# Altium project meltdown_hardware.PrjPcb
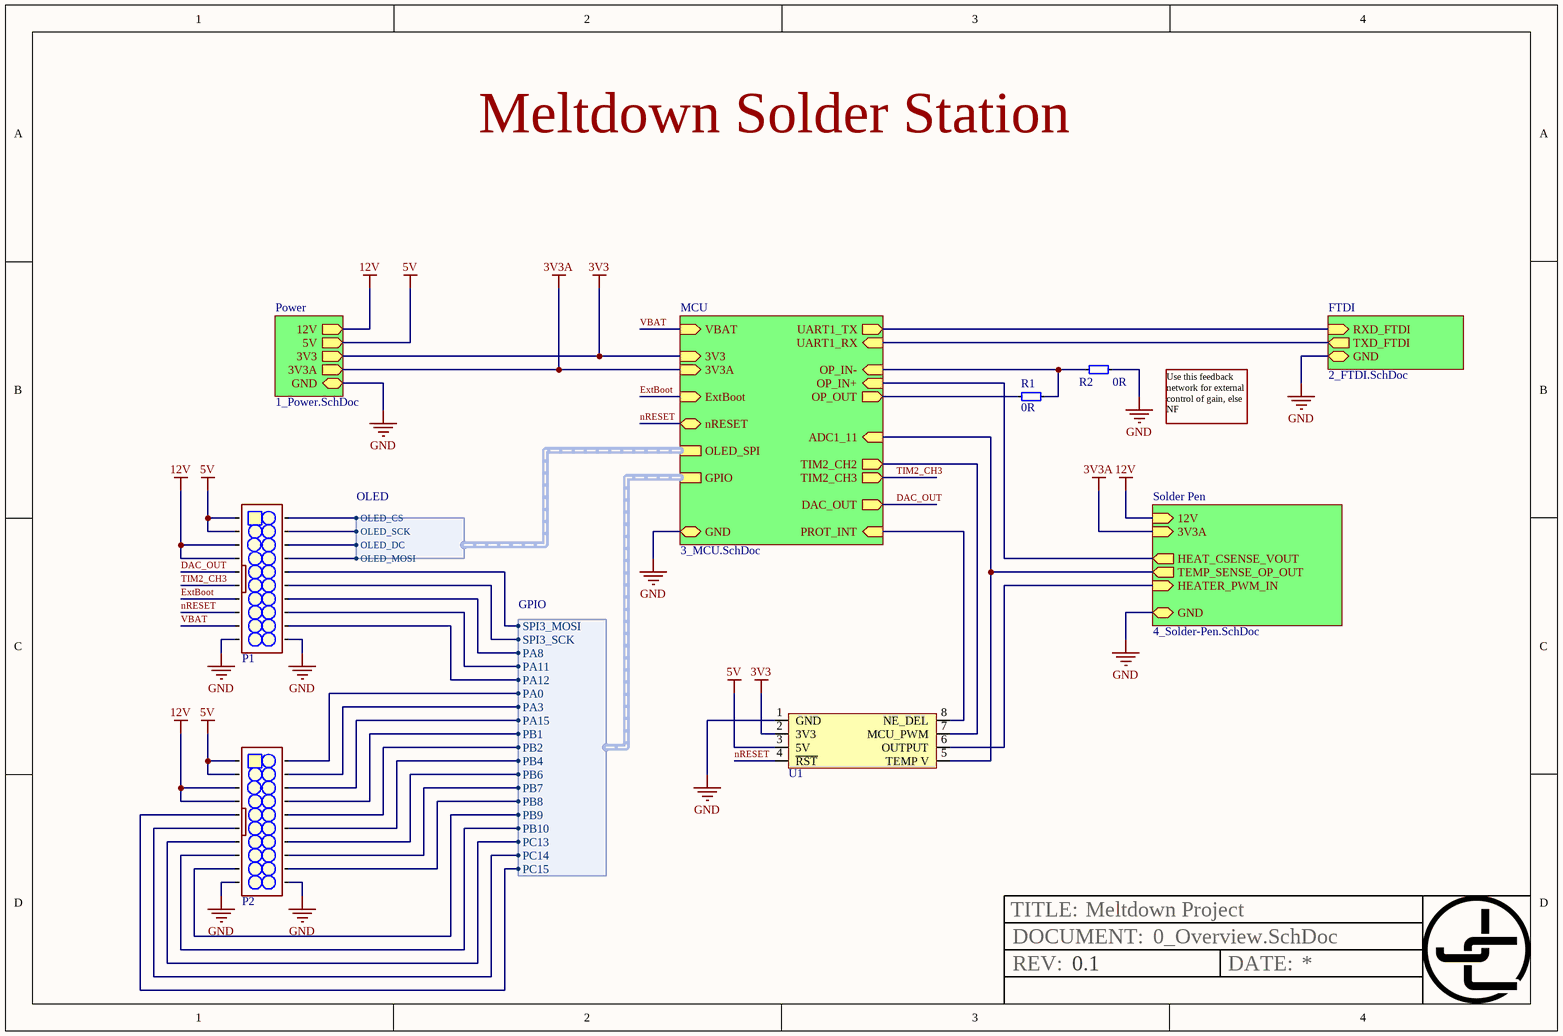
[diagram p0: 0_Overview.SchDoc]
Revision: 0.1; Team: JC; Title: Meltdown Project
5 sheets, 95 parts. Net scope: strictly hierarchical (ports join the sheet entries above them; power ports are local).
Board file: meltdown_hardware.PcbDoc
Sheets:
  0_Overview.SchDoc
    Power = 1_Power.SchDoc
    FTDI = 2_FTDI.SchDoc
    MCU = 3_MCU.SchDoc
    Solder Pen = 4_Solder-Pen.SchDoc

## Sheet 0_Overview.SchDoc: Meltdown Project
size A4; SheetNumber: 1; SheetTotal: 5

### Parts
P1  2x10 Ribbon Header  [2x10_RIBBON_CABLE_CON]  (value not drawn)
P2  2x10 Ribbon Header  [2x10_RIBBON_CABLE_CON]  (value not drawn)
R1  value 0R  [0603]  (hidden comment: 0603, resistor)
R2  value 0R  [0603]  (hidden comment: 0603, resistor)
U1  Meltdown Protection Module  [MELTDOWN_PROT]  (value not drawn)

### Sub-sheets
FTDI = 2_FTDI.SchDoc: TXD_FTDI (out), RXD_FTDI (in), GND (bidir)
MCU = 3_MCU.SchDoc: VBAT (in), 3V3 (in), ExtBoot (in), nRESET (bidir), GND (bidir), OP_IN- (in), OP_IN+ (in), OP_OUT (out), TIM2_CH2 (out), TIM2_CH3 (out), ADC1_11 (in), UART1_TX (out), UART1_RX (in), DAC_OUT (out), OLED_SPI (harness OLED), GPIO (harness GPIO), 3V3A (in), PROT_INT (in)
Power = 1_Power.SchDoc: 3V3 (out), GND (bidir), 5V (out), 12V (out), 3V3A (out)
Solder Pen = 4_Solder-Pen.SchDoc: HEATER_PWM_IN (in), 12V (in), GND (bidir), TEMP_SENSE_OP_OUT (out), HEAT_CSENSE_VOUT (out), 3V3A (in)

### Harnesses
OLED: OLED_CS, OLED_SCK, OLED_DC, OLED_MOSI
GPIO: SPI3_MOSI, SPI3_SCK, PA8, PA11, PA12, PA0, PA3, PA15, PB1, PB2, PB4, PB6, PB7, PB8, PB9, PB10, PC13, PC14, PC15

### Nets
3V3: U1.2(3V3) ; sheet Power/3V3, sheet MCU/3V3
3V3A: sheet Power/3V3A, sheet MCU/3V3A, sheet Solder Pen/3V3A
5V: P1.1 P1.2 P2.1 P2.2 U1.3(5V) ; sheet Power/5V
12V: P1.3 P1.4 P2.3 P2.4 ; sheet Power/12V, sheet Solder Pen/12V
GND: P1.10 P1.11 P2.10 P2.11 R2.0 U1.1(GND) ; sheet Power/GND, sheet FTDI/GND, sheet MCU/GND, sheet Solder Pen/GND
ADC1_11: U1.5(TEMP_V) ; sheet MCU/ADC1_11, sheet Solder Pen/TEMP_SENSE_OP_OUT
DAC_OUT: P1.5 ; sheet MCU/DAC_OUT
ExtBoot: P1.7 ; sheet MCU/ExtBoot
HEAT_CSENSE_VOUT: sheet MCU/OP_IN+, sheet Solder Pen/HEAT_CSENSE_VOUT
nRESET: P1.8 U1.4(~{RST}) ; sheet MCU/nRESET
OP_IN-: R1.1 R2.1 ; sheet MCU/OP_IN-
OP_OUT: R1.0 ; sheet MCU/OP_OUT
PA0: P2.20 ; sheet MCU/GPIO.PA0
PA3: P2.19 ; sheet MCU/GPIO.PA3
PA8: P1.14 ; sheet MCU/GPIO.PA8
PA11: P1.13 ; sheet MCU/GPIO.PA11
PA12: P1.12 ; sheet MCU/GPIO.PA12
PA15: P2.18 ; sheet MCU/GPIO.PA15
PB1: P2.17 ; sheet MCU/GPIO.PB1
PB2: P2.16 ; sheet MCU/GPIO.PB2
PB4: P2.15 ; sheet MCU/GPIO.PB4
PB6: P2.14 ; sheet MCU/GPIO.PB6
PB7: P2.13 ; sheet MCU/GPIO.PB7
PB8: P2.12 ; sheet MCU/GPIO.PB8
PB9: P2.9 ; sheet MCU/GPIO.PB9
PB10: P2.8 ; sheet MCU/GPIO.PB10
PC13: P2.7 ; sheet MCU/GPIO.PC13
PC14: P2.6 ; sheet MCU/GPIO.PC14
PC15: P2.5 ; sheet MCU/GPIO.PC15
PROT_INT: U1.8(NE_DEL) ; sheet MCU/PROT_INT
RXD: sheet FTDI/RXD_FTDI, sheet MCU/UART1_TX
SPI3_MOSI: P1.16 ; sheet MCU/GPIO.SPI3_MOSI
SPI3_SCK: P1.15 ; sheet MCU/GPIO.SPI3_SCK
TIM2_2: U1.7(MCU_PWM) ; sheet MCU/TIM2_CH2
TIM2_CH3: P1.6 ; sheet MCU/TIM2_CH3  [project net TIM2_3]
TXD: sheet FTDI/TXD_FTDI, sheet MCU/UART1_RX
VBAT: P1.9 ; sheet MCU/VBAT
NetP1_17: P1.17 ; sheet MCU/OLED_SPI.OLED_MOSI
NetP1_18: P1.18 ; sheet MCU/OLED_SPI.OLED_DC
NetP1_19: P1.19 ; sheet MCU/OLED_SPI.OLED_SCK
NetP1_20: P1.20 ; sheet MCU/OLED_SPI.OLED_CS
NetR400_1: U1.6(OUTPUT) ; sheet Solder Pen/HEATER_PWM_IN

### Notes on the sheet
- Meltdown Solder Station
- Use this feedback network for external control of gain, else NF
- TITLE:
- REV:
- DOCUMENT:
- DATE:

### Library data of the parts
P1 P2 = 2x10 Ribbon Header: 2.54 mm; Value: 1x10 Pin Header
U1 = Meltdown Protection Module: Protection circuit for the meltdown project

## Sheet 1_Power.SchDoc: Meltdown Project
size A4; SheetNumber: 2; SheetTotal: 5
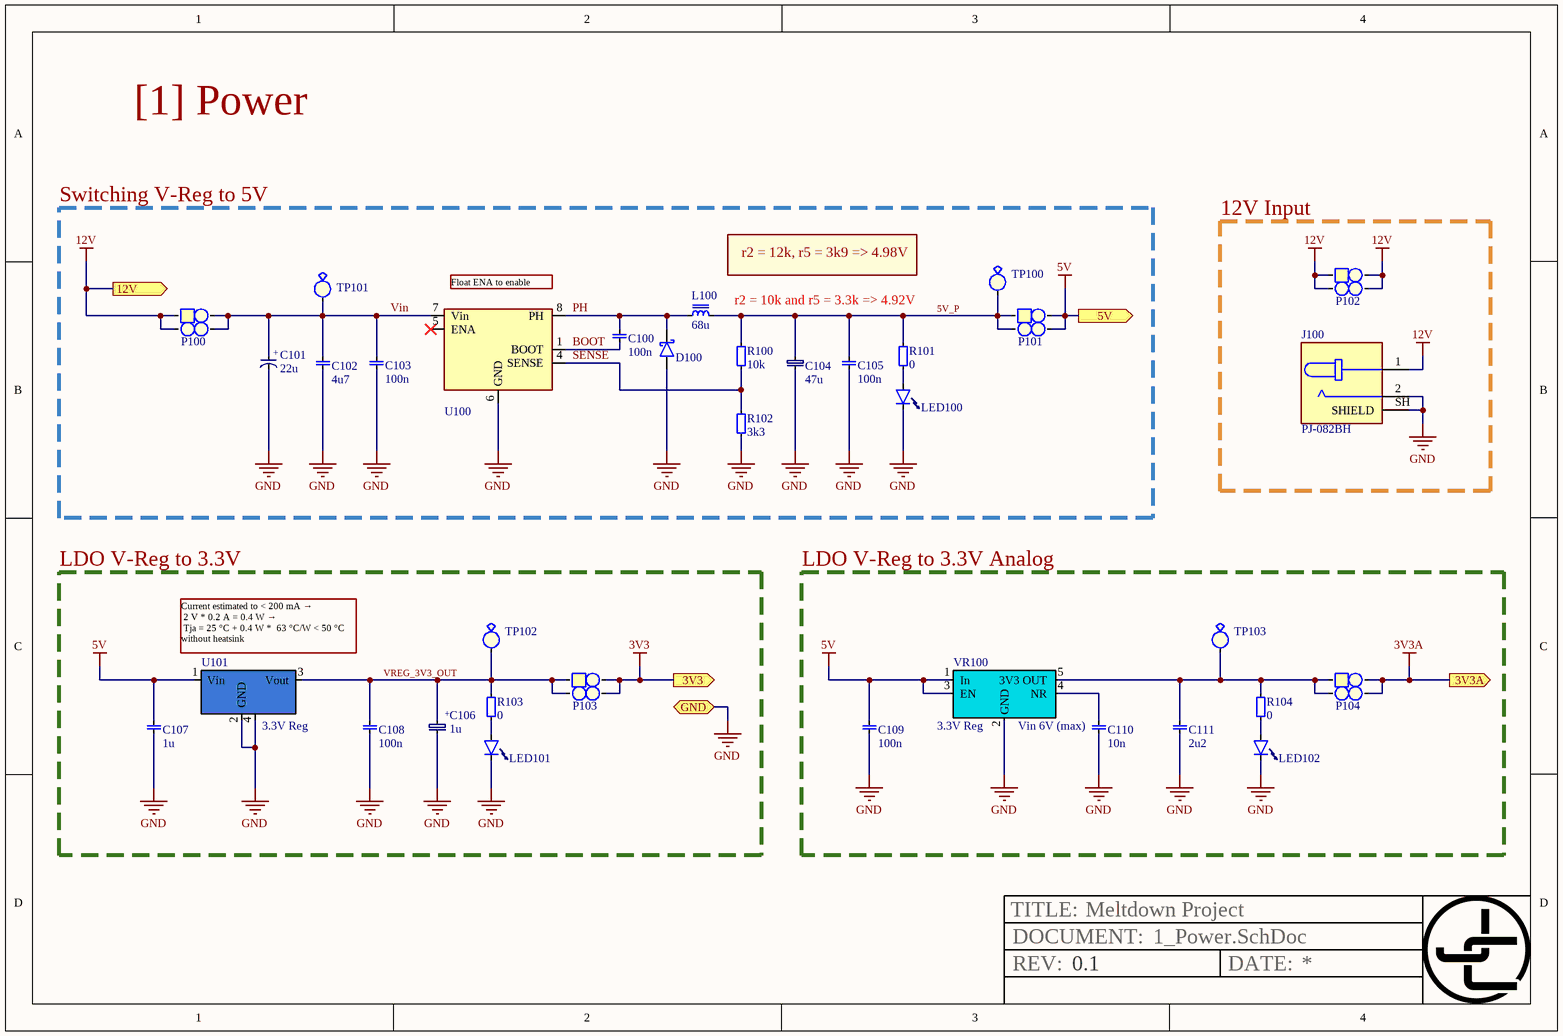
[diagram p1: 1_Power.SchDoc]

### Parts
C100  value 100n  [1210, cap]  (hidden comment: 1210, capacitor)
C101  value 22u  [EEEFT1E220AR]  (hidden comment: cap, Electrolyt Case B)
C102  value 4u7  [1812, cap]  (hidden comment: 1812, capacitor)
C103  value 100n  [1210, cap]  (hidden comment: 1210, capacitor)
C104  value 47u  [CASE_E]  (hidden comment: cap, Case E)
C105  value 100n  [1210, cap]  (hidden comment: 1210, capacitor)
C106  value 1u  [CASE_B]  (hidden comment: Cap, case B)
C107  value 1u  [0603 cap]  (hidden comment: 0603, capacitor)
C108  value 100n  [0603 cap]  (hidden comment: 0603, capacitor)
C109  value 100n  [0603 cap]  (hidden comment: 0603, capacitor)
C110  value 10n  [0603 cap]  (hidden comment: 0603, capacitor)
C111  value 2u2  [0603 cap]  (hidden comment: 0603, capacitor)
D100  B340A-E3/61T  [DO-214AC]  (value not drawn)
J100  PJ-082BH  [CUI_PJ-082BH]
L100  value 68u  [MSS1260]  (hidden comment: Coil, MSS1260)
LED100  0603, LED  [0603 LED]  (value not drawn)
LED101  0603, LED  [0603 LED]  (value not drawn)
LED102  0603, LED  [0603 LED]  (value not drawn)
P100  2x2 Pin Header  [2x2 PH]  (value not drawn)
P101  2x2 Pin Header  [2x2 PH]  (value not drawn)
P102  2x2 Pin Header  [2x2 PH]  (value not drawn)
P103  2x2 Pin Header  [2x2 PH]  (value not drawn)
P104  2x2 Pin Header  [2x2 PH]  (value not drawn)
R100  value 10k  [0603]  (hidden comment: 0603, resistor)
R101  value 0  [0603]  (hidden comment: 0603, resistor)
R102  value 3k3  [0603]  (hidden comment: 0603, resistor)
R103  value 0  [0603]  (hidden comment: 0603, resistor)
R104  value 0  [0603]  (hidden comment: 0603, resistor)
TP100  Test Point  [testPoint]  (value not drawn)
TP101  Test Point  [testPoint]  (value not drawn)
TP102  Test Point  [testPoint]  (value not drawn)
TP103  Test Point  [testPoint]  (value not drawn)
U100  TPS5410  [SOIC8]  (value not drawn)
U101  3.3V Reg  [SOT223]
VR100  3.3V Reg  Input Voltage: Vin 6V (max)  [SOT23-5]

### Blocks framed on the sheet
Switching V-Reg to 5V: C100-C105 D100 L100 LED100 P100 P101 R100-R102 TP100 TP101 U100
12V Input: J100 P102
LDO V-Reg to 3.3V: C106-C108 LED101 P103 R103 TP102 U101
LDO V-Reg to 3.3V Analog: C109-C111 LED102 P104 R104 TP103 VR100

### Ports
3V3 (out), 3V3A (out), 5V (out), 12V (out), GND (bidir)

### Nets
3V3: P103.3 P103.4 ; port 3V3
3V3A: P104.3 P104.4 ; port 3V3A
5V: C107.1 C109.1 P101.3 P101.4 U101.1(Vin) VR100.1(In) VR100.3(EN) ; port 5V
12V: J100.1 P100.1 P100.2 P102.1 P102.2 P102.3 P102.4 ; port 12V
GND: C101.1 C102.0 C103.0 C104.2 C105.0 C106.1 C107.0 C108.0 C109.0 C110.0 C111.0 D100.2(A) J100.2 J100.SH(SHIELD) LED100.0(Cathode) LED101.0(Cathode) LED102.0(Cathode) R102.1 U100.6(GND) U101.2(GND) U101.4 VR100.2(GND) ; port GND
5V_P: C104.1 C105.1 L100.1 P101.1 P101.2 R100.0 R101.0 TP100.0
BOOT: C100.0 U100.1(BOOT)
PH: C100.1 D100.1(K) L100.2 U100.8(PH)
SENSE: R100.1 R102.0 U100.4(SENSE)
Vin: C101.2 C102.1 C103.1 P100.3 P100.4 TP101.0 U100.7(Vin)
VREG_3V3_OUT: C106.2 C108.1 P103.1 P103.2 R103.0 TP102.0 U101.3(Vout)
NetC110_1: C110.1 VR100.4(NR)
NetC111_1: C111.1 P104.1 P104.2 R104.0 TP103.0 VR100.5(3V3_OUT)
NetLED100_1: LED100.1 R101.1
NetLED101_1: LED101.1 R103.1
NetLED102_1: LED102.1 R104.1

Not connected (* = marked no-connect by the designer): U100 5(ENA)*

### Notes on the sheet
- [1] Power
- (near U100) Float ENA to enable
- r2 = 10k and r5 = 3.3k => 4.92V
- r2 = 12k, r5 = 3k9 => 4.98V
- (near U101) Current estimated to < 200 mA →
  2 V * 0.2 A = 0.4 W →
  Tja = 25 °C + 0.4 W *  63 °C/W < 50 °C without heatsink
- TITLE:
- REV:
- DOCUMENT:
- DATE:
- (in symbol Cap, case B) +
- (in symbol cap, Electrolyt Case B) +

### Library data of the parts
C100 C103 C105 = 1210, capacitor: Order number: 478-1556-1-ND; Supplier: Digikey
C102 = 1812, capacitor: Part Number: C1812C475K5RACTU; Order Number: 399-8255-1-ND
C104 = cap, Case E: Tantalum; Part Number: TPSE476K020R0200; Order Number: *
D100 = B340A-E3/61T: SchottkydiodE, 40 V, 3 A; Value: Schottky Diode; Farnell: 2335183
J100 = Power Jack: 2.5 x 6.5 mm, 10.0 A, Horizontal, Through Hole, Shielded, Dc Power Jack Connector; MF: CUI Devices; Package: None; Availability: In Stock; Part Number: PJ-082BH; MP: PJ-082BH; CUI_purchase_URL: https://www.cuidevices.com/product/interconnect/connectors/dc-power-connectors/jacks/pj-082bh?utm_source=snapeda.com&utm_medium=referral&utm_campaign=snapedaBOM; Price: None; Purchase-URL: https://pricing.snapeda.com/search/part/PJ-082BH/?ref=eda; Digikey part nbr: CP-082BHTR-ND
L100 = Coil, MSS1260: 68 µH, 2.3 A,; Part Number: SRR1260-680M; Order Number: *
P100-P104 = 2x2 Pin Header: Value: 2x2 Pin Header, 2.54mm
U100 = TPS5410: 1-A, Wide Input Range, Step-Down Converter; Value: *; Supplier: *; Order Number: *
U101 = MCP1826S: 1 A, Positive Fixed-Voltage, Low-ccDropout Regulator; Drop Out: 250mV; Value: MCP1826S; Farnell: 1287689
VR100 = TPS79333DBR: 3.3V Reg, Ultra-Low Noise, 200 mA; Value: TPS79333DBVR; Drop Out: 102mV; Farnell: 1287689
LED100-LED102 = 0603, LED
  LED100: Order Number: *
TP100-TP103 = Test Point: Value: Test point; Farnell: 1702006

## Sheet 2_FTDI.SchDoc: Meltdown Project
size A4; SheetNumber: 3; SheetTotal: 5
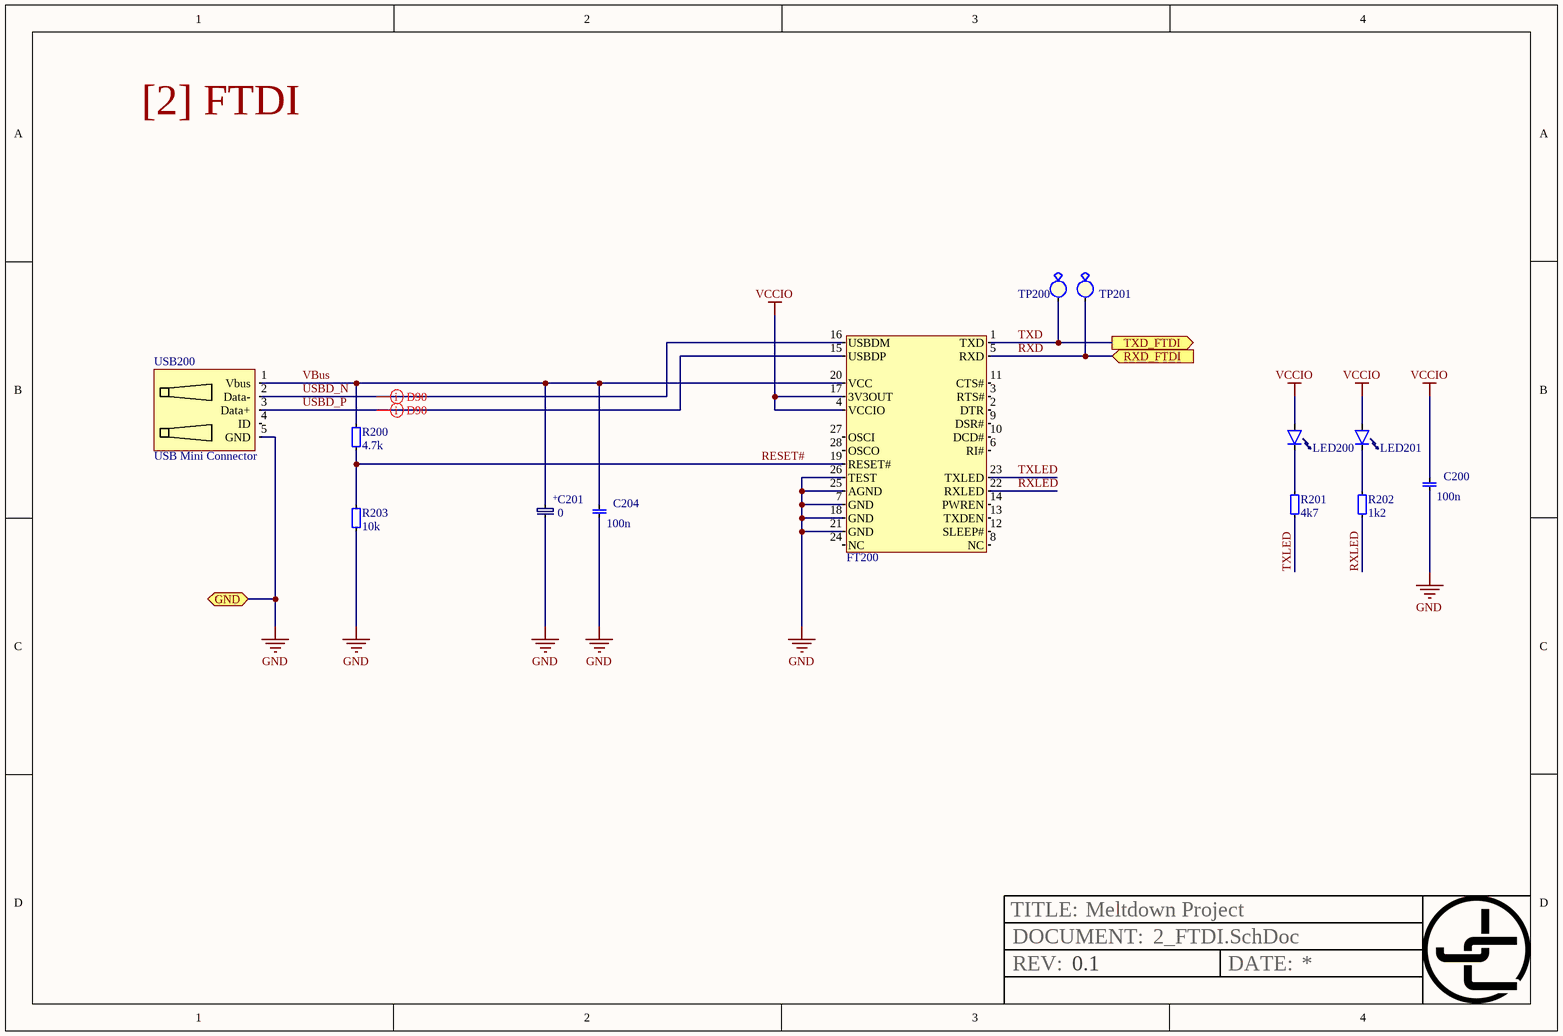
[diagram p2: 2_FTDI.SchDoc]

### Parts
C200  value 100n  [0603 cap]  (hidden comment: 0603, capacitor)
C201  value 0  [CASE_B]  (hidden comment: Cap, case B)
C204  value 100n  [0603 cap]  (hidden comment: 0603, capacitor)
FT200  FT232R  [SOP28]  (value not drawn)
LED200  0805, LED  [0805_led]  (value not drawn)
LED201  0805, LED  [0805_led]  (value not drawn)
R200  value 4.7k  [0603]  (hidden comment: 0603, resistor)
R201  value 4k7  [0603]  (hidden comment: 0603, resistor)
R202  value 1k2  [0603]  (hidden comment: 0603, resistor)
R203  value 10k  [0603]  (hidden comment: 0603, resistor)
TP200  Test Point  [testPoint]  (value not drawn)
TP201  Test Point  [testPoint]  (value not drawn)
USB200  USB Mini Connector  [USB Mini TH]

### Ports
GND (bidir), RXD_FTDI (in), TXD_FTDI (out)

### Nets
GND: C200.0 C201.1 C204.0 FT200.7(GND) FT200.18(GND) FT200.21(GND) FT200.25(AGND) FT200.26(TEST) R203.1 USB200.5(GND) ; port GND
VCCIO: C200.1 FT200.4(VCCIO) FT200.17(3V3OUT) LED200.1 LED201.1
RESET#: FT200.19(RESET#) R200.1 R203.0
RXD: FT200.5(RXD) TP201.0 ; port RXD_FTDI
RXLED: FT200.22(RXLED) R202.1
TXD: FT200.1(TXD) TP200.0 ; port TXD_FTDI
TXLED: FT200.23(TXLED) R201.1
USBD_N: FT200.16(USBDM) USB200.2(Data-)
USBD_P: FT200.15(USBDP) USB200.3(Data+)
VBus: C201.2 C204.1 FT200.20(VCC) R200.0 USB200.1(Vbus)
NetLED200_0: LED200.0(Cathode) R201.0
NetLED201_0: LED201.0(Cathode) R202.0

Not connected (* = marked no-connect by the designer): FT200 2(DTR) 3(RTS#) 6(RI#) 8(NC) 9(DSR#) 10(DCD#) 11(CTS#) 12(SLEEP#) 13(TXDEN) 14(PWREN) 24(NC) 27(OSCI) 28(OSCO); USB200 4(ID)

### Layout directives
differential pair; differential pair class USB2.0: USBD_N, USBD_P

### Notes on the sheet
- [2] FTDI
- TITLE:
- REV:
- DOCUMENT:
- DATE:
- (in symbol Cap, case B) +

### Library data of the parts
FT200 = FT232R: USB UART IC; Value: FT232R; DigiKey: 768-1007-1-ND; Farnell: 1146032
LED200 LED201 = 0805, LED: Value: 0805 LED
C200 C204 = 0603, capacitor: Order number: *
TP200 TP201 = Test Point: Value: Test point; Farnell: 1702006
USB200 = USB Mini Connector: Value: USB Mini Connector; Farnell: 1125348

## Sheet 3_MCU.SchDoc: Meltdown Project
size A4; SheetNumber: 4; SheetTotal: 5
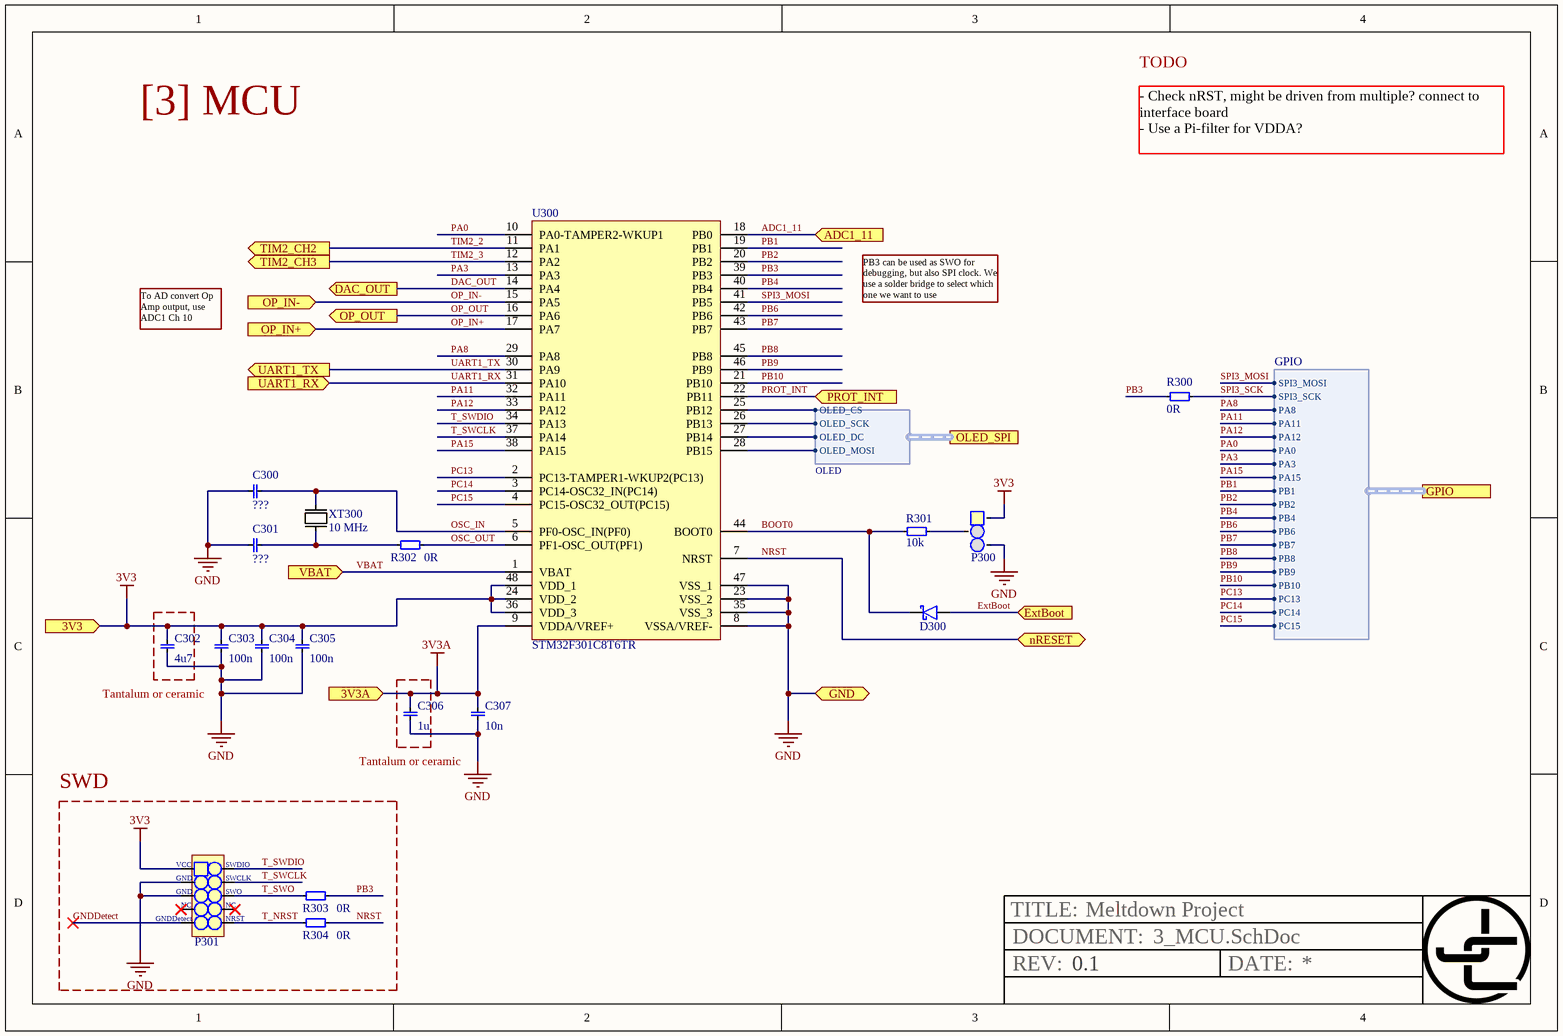
[diagram p3: 3_MCU.SchDoc]

### Parts
C300  value ???  [0805, cap]  (hidden comment: 0805, capacitor)
C301  value ???  [0805, cap]  (hidden comment: 0805, capacitor)
C302  value 4u7  [0805, cap]  (hidden comment: 0805, capacitor)
C303  value 100n  [0805, cap]  (hidden comment: 0805, capacitor)
C304  value 100n  [0805, cap]  (hidden comment: 0805, capacitor)
C305  value 100n  [0805, cap]  (hidden comment: 0805, capacitor)
C306  value 1u  [0805, cap]  (hidden comment: 0805, capacitor)
C307  value 10n  [0805, cap]  (hidden comment: 0805, capacitor)
D300  B340A  [DO-214AC]  (value not drawn)
P300  1x3 Pin Header Mux  [padThree_L]  (value not drawn)
P301  ARM 10 pin SWD  [FTSH-105-01-L-DV-K even odd]  (value not drawn)
R300  value 0R  [0603]  (hidden comment: 0603, resistor)
R301  value 10k  [0603]  (hidden comment: 0603, resistor)
R302  value 0R  [0603]  (hidden comment: 0603, resistor)
R303  value 0R  [0603]  (hidden comment: 0603, resistor)
R304  value 0R  [0603]  (hidden comment: 0603, resistor)
U300  STM32F301C8T6TR  [STM-LQFP48_L]
XT300  value 10 MHz  [XTAL_SMD_LP]  (hidden comment: XTAL ABM3)

### Ports
3V3 (in), 3V3A (in), ADC1_11 (in), DAC_OUT (out), ExtBoot (in), GND (bidir), GPIO (harness GPIO), nRESET (bidir), OLED_SPI (harness OLED), OP_IN+ (in), OP_IN- (in), OP_OUT (out), PROT_INT (in), TIM2_CH2 (out), TIM2_CH3 (out), UART1_RX (in), UART1_TX (out), VBAT (in)

### Harnesses
OLED: OLED_CS, OLED_SCK, OLED_DC, OLED_MOSI
GPIO: PB1, PB2, PB4, PB6, PB7, PB8, PB9, PB10, PC13, PC14, PC15, PA0, PA12, PA11, PA8, SPI3_SCK, SPI3_MOSI, PA3, PA15

### Nets
3V3: C302.1 C303.1 C304.1 C305.1 P300.1 P301.1(VCC) U300.24(VDD_2) U300.36(VDD_3) U300.48(VDD_1) ; port 3V3
3V3A: C306.1 C307.1 U300.9(VDDA/VREF+) ; port 3V3A
GND: C300.1 C301.1 C302.0 C303.0 C304.0 C305.0 C306.0 C307.0 P300.3 P301.3(GND) P301.5(GND) U300.8(VSSA/VREF-) U300.23(VSS_2) U300.35(VSS_3) U300.47(VSS_1) ; port GND
ADC1_11: U300.18(PB0) ; port ADC1_11
BOOT0: D300.1(K) R301.1 U300.44(BOOT0)
DAC_OUT: U300.14(PA4) ; port DAC_OUT
ExtBoot: D300.2(A) ; port ExtBoot
GNDDetect: P301.9(GNDDetect)
NRST: R304.0 U300.7(NRST) ; port nRESET  [project net nRESET]
OP_IN+: U300.17(PA7) ; port OP_IN+  [project net HEAT_CSENSE_VOUT]
OP_IN-: U300.15(PA5) ; port OP_IN-
OP_OUT: U300.16(PA6) ; port OP_OUT
OSC_IN: C300.0 U300.5(PF0-OSC_IN(PF0)) XT300.2
OSC_OUT: R302.0 U300.6(PF1-OSC_OUT(PF1))
PA0: U300.10(PA0-TAMPER2-WKUP1) ; port GPIO.PA0
PA3: U300.13(PA3) ; port GPIO.PA3
PA8: U300.29(PA8) ; port GPIO.PA8
PA11: U300.32(PA11) ; port GPIO.PA11
PA12: U300.33(PA12) ; port GPIO.PA12
PA15: U300.38(PA15) ; port GPIO.PA15
PB1: U300.19(PB1) ; port GPIO.PB1
PB2: U300.20(PB2) ; port GPIO.PB2
PB3: R300.1 R303.0 U300.39(PB3)
PB4: U300.40(PB4) ; port GPIO.PB4
PB6: U300.42(PB6) ; port GPIO.PB6
PB7: U300.43(PB7) ; port GPIO.PB7
PB8: U300.45(PB8) ; port GPIO.PB8
PB9: U300.46(PB9) ; port GPIO.PB9
PB10: U300.21(PB10) ; port GPIO.PB10
PC13: U300.2(PC13-TAMPER1-WKUP2(PC13)) ; port GPIO.PC13
PC14: U300.3(PC14-OSC32_IN(PC14)) ; port GPIO.PC14
PC15: U300.4(PC15-OSC32_OUT(PC15)) ; port GPIO.PC15
PROT_INT: U300.22(PB11) ; port PROT_INT
SPI3_MOSI: U300.41(PB5) ; port GPIO.SPI3_MOSI
SPI3_SCK: R300.0 ; port GPIO.SPI3_SCK
T_NRST: P301.10(NRST) R304.1
T_SWCLK: P301.4(SWCLK) U300.37(PA14)
T_SWDIO: P301.2(SWDIO) U300.34(PA13)
T_SWO: P301.6(SWO) R303.1
TIM2_2: U300.11(PA1) ; port TIM2_CH2
TIM2_3: U300.12(PA2) ; port TIM2_CH3
UART1_RX: U300.31(PA10) ; port UART1_RX  [project net TXD]
UART1_TX: U300.30(PA9) ; port UART1_TX  [project net RXD]
VBAT: U300.1(VBAT) ; port VBAT
NetC301_0: C301.0 R302.1 XT300.1
NetP1_17: U300.28(PB15) ; port OLED_SPI.OLED_MOSI
NetP1_18: U300.27(PB14) ; port OLED_SPI.OLED_DC
NetP1_19: U300.26(PB13) ; port OLED_SPI.OLED_SCK
NetP1_20: U300.25(PB12) ; port OLED_SPI.OLED_CS
NetP300_2: P300.2 R301.0

Not connected (* = marked no-connect by the designer): P301 7(NC)* 8(NC)*

### Notes on the sheet
- [3] MCU
- TODO
- - Check nRST, might be driven from multiple? connect to interface board
  - Use a Pi-filter for VDDA?
- PB3 can be used as SWO for debugging, but also SPI clock. We use a solder bridge to select which one we want to use
- To AD convert Op Amp output, use ADC1 Ch 10
- Tantalum or ceramic
- SWD
- TITLE:
- REV:
- DOCUMENT:
- DATE:

### Library data of the parts
D300 = B340A-E3/61T: SchottkydiodE, 40 V, 3 A; Value: Schottky Diode; Farnell: 2335183
P300 = 1x3 Pin Header Mux: 2.54 mm; Value: 1x3 Pin Header
P301 = ARM 10 pin SWD: 1.27mm, PH; Value: 2x5 Pin Header, 2.54mm, Th; Digikey: FTSH-105-01-L-DV-K
U300 = STM32F301C8T6TR: MCU 32-bit ARM Cortex M4 RISC 64KB Flash 2.5V/3.3V 48-Pin LQFP T/R; Supplier 1: Mouser; Supplier Part Number 1: 511-STM32F301C8T6TR
XT300 = XTAL TXC 7A: 10 MHz, SMD, 5mm x 3,2mm, 30 ppm; Mf. nbr: ABM3-10.000MHZ-D2Y-T; CL: 18 pF; ESR: 60 R; C0: 7 pF (max); Farnell: 1841946

## Sheet 4_Solder-Pen.SchDoc: Meltdown Project
size A4; SheetNumber: 5; SheetTotal: 5; SPICEModelCacheUOHFEEZY: <root> / <DocumentId>UOHFEEZY</DocumentId> / </root>
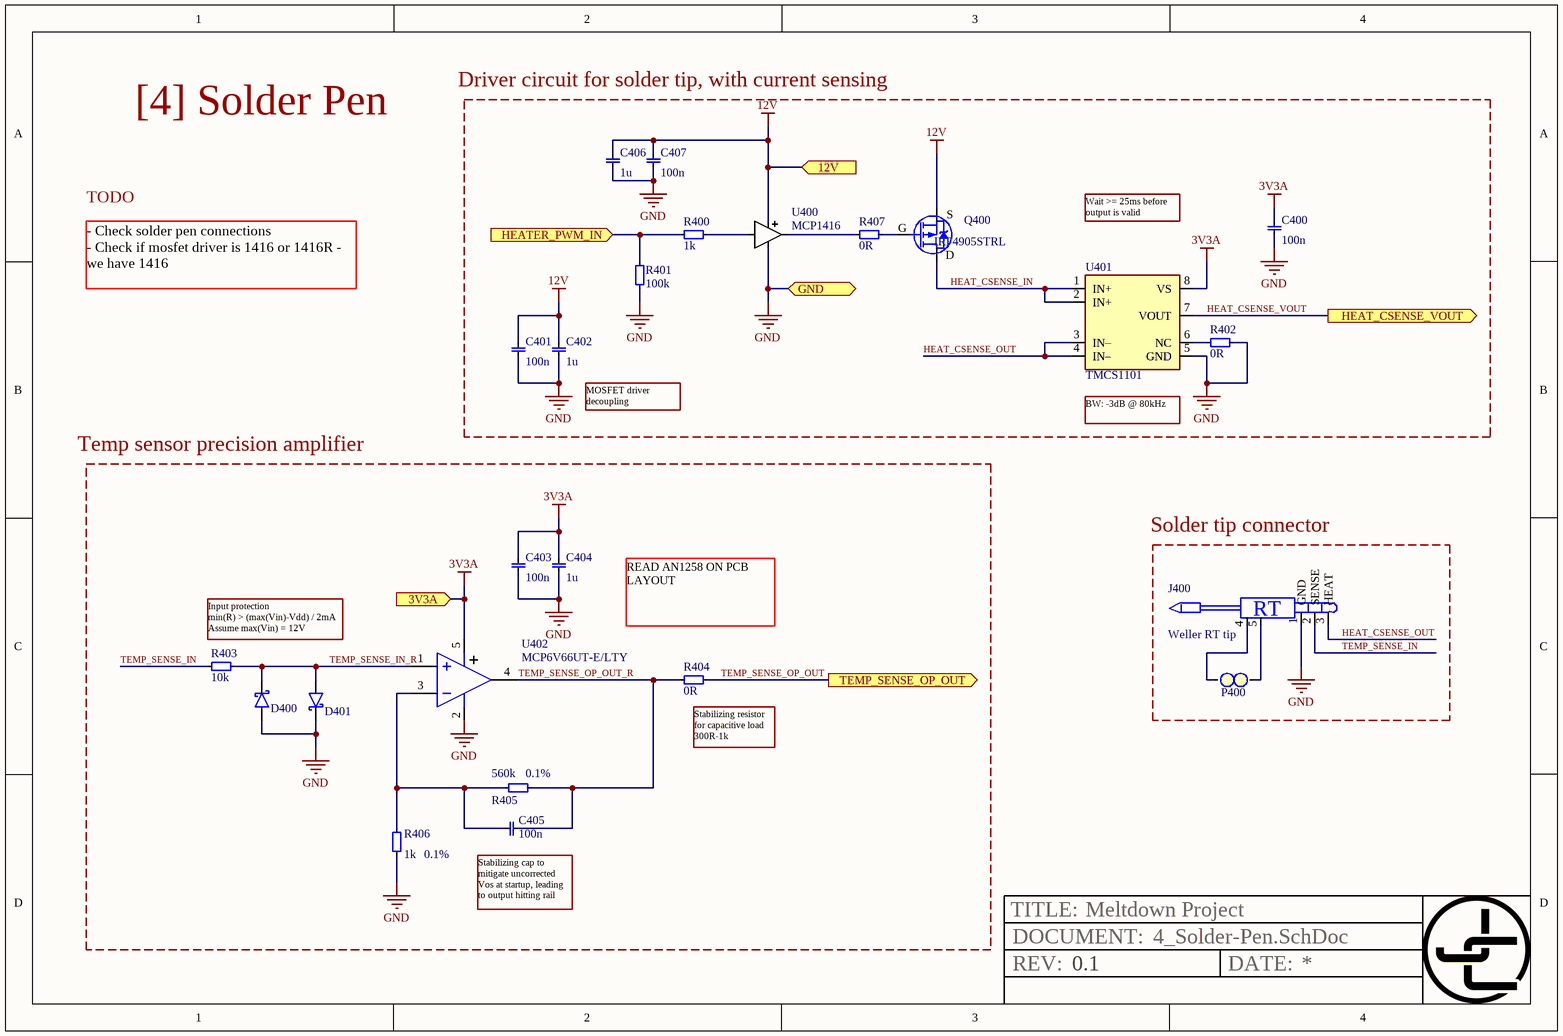
[diagram p4: 4_Solder-Pen.SchDoc]

### Parts
C400  value 100n  [0805, cap]  (hidden comment: 0805, capacitor)
C401  value 100n  [0805, cap]  (hidden comment: 0805, capacitor)
C402  value 1u  [0805, cap]  (hidden comment: 0805, capacitor)
C403  value 100n  [0805, cap]  (hidden comment: 0805, capacitor)
C404  value 1u  [0805, cap]  (hidden comment: 0805, capacitor)
C405  value 100n  [0805, cap]  (hidden comment: 0805, capacitor)
C406  value 1u  [0805, cap]  (hidden comment: 0805, capacitor)
C407  value 100n  [0805, cap]  (hidden comment: 0805, capacitor)
D400  B340A  [DO-214AC]  (value not drawn)
D401  B340A  [DO-214AC]  (value not drawn)
J400  Weller RT tip  [5 POLE BLOCK CONNECTOR]
P400  1x2 Pin Heade Straight  [padtwo_L]  (value not drawn)
Q400  IRF4905  [d2pak]  (value not drawn)
R400  value 1k  [0603]  (hidden comment: 0603, resistor)
R401  value 100k  [0603]  (hidden comment: 0603, resistor)
R402  value 0R  [0603]  (hidden comment: 0603, resistor)
R403  value 10k  [0603]  (hidden comment: 0603, resistor)
R404  value 0R  [0603]  (hidden comment: 0603, resistor)
R405  value 560k  Tolerance: 0.1%  [0603]  (hidden comment: 0603, resistor)
R406  value 1k  Tolerance: 0.1%  [0603]  (hidden comment: 0603, resistor)
R407  value 0R  [0603]  (hidden comment: 0603, resistor)
U400  MCP1416  [SOT23-5]
U401  TMCS1101  [SOIC8]
U402  MCP6V66UT-E/LTY  [SC70P210X110-5N]

### Blocks framed on the sheet
IRF4905STRL: C400-C402 C406 C407 Q400 R400-R402 R407 U400 U401

### Ports
3V3A (in), 12V (in), GND (bidir), HEAT_CSENSE_VOUT (out), HEATER_PWM_IN (in), TEMP_SENSE_OP_OUT (out)

### Nets
3V3A: C400.1 C403.1 C404.1 U401.8(VS) U402.5(V+) ; port 3V3A
12V: C401.1 C402.1 C406.1 C407.1 Q400.3(S) U400.5 ; port 12V
GND: C400.0 C401.0 C402.0 C403.0 C404.0 C406.0 C407.0 D400.2(A) D401.1(K) J400.1(GND) R401.1 R402.1 R406.1 U400.2 U401.5(GND) U402.2(V-) ; port GND
HEAT_CSENSE_IN: Q400.2(D) U401.1(IN+) U401.2(IN+)
HEAT_CSENSE_OUT: J400.3(HEAT) U401.3(IN–) U401.4(IN–)
HEAT_CSENSE_VOUT: U401.7(VOUT) ; port HEAT_CSENSE_VOUT
TEMP_SENSE_IN: J400.2(SENSE) R403.0
TEMP_SENSE_IN_R: D400.1(K) D401.2(A) R403.1 U402.1(IN+)
TEMP_SENSE_OP_OUT: R404.1 ; port TEMP_SENSE_OP_OUT  [project net ADC1_11]
TEMP_SENSE_OP_OUT_R: C405.0 R404.0 R405.1 U402.4(OUT)
NetC405_1: C405.1 R405.0 R406.0 U402.3(IN-)
NetJ400_4: J400.4 P400.1
NetJ400_5: J400.5 P400.2
NetQ400_1: Q400.1(G) R407.0
NetR400_0: R400.0 U400.3
NetR400_1: R400.1 R401.0 ; port HEATER_PWM_IN
NetR402_0: R402.0 U401.6(NC)
NetR407_1: R407.1 U400.4

### Notes on the sheet
- [4] Solder Pen
- Driver circuit for solder tip, with current sensing
- TODO
- Wait >= 25ms before
  output is valid
- - Check solder pen connections
  - Check if mosfet driver is 1416 or 1416R - we have 1416
- Temp sensor precision amplifier
- (near C402) MOSFET driver decoupling
- BW: -3dB @ 80kHz
- Solder tip connector
- (near R403) Input protection
  min(R) > (max(Vin)-Vdd) / 2mA
  Assume max(Vin) = 12V
- READ AN1258 ON PCB LAYOUT
- (near R404) Stabilizing resistor
  for capacitive load
  300R-1k
- (near C405) Stabilizing cap to
  mitigate uncorrected
  Vos at startup, leading
  to output hitting rail
- TITLE:
- REV:
- DOCUMENT:
- DATE:
- (in symbol Weller RT tip) RT

### Library data of the parts
D400 D401 = B340A-E3/61T: SchottkydiodE, 40 V, 3 A; Value: Schottky Diode; Farnell: 2335183
P400 = 1x2 Pin Heade Straight: 2.54 mm, TH; Value: 1x2 Pin Header
Q400 = IRF4905: P-Channel HEXFET® Power MOSFET
U400 = MCP1416: High-speed Power MOSFET driver
U401 = TMCS1101: Hall-Effect Current Sensor
U402 = MCP6V66UT-E/LTY: Linear High Precision Op Amps-Chopper Stabilized, 1000kHz, 1.8Vto5.5V, SC70-5, RoHS; Manufacturer: Microchip; Supplier 1: Avnet; Manufacturer Part Number: MCP6V66UT-E/LTY; RoHS: No; Category: Amplifiers - Op Amps, Buffer, Instrumentation; Stock 1: 50; Pricing 1: 3000=0,93150 (USD); Supplier Part Number 1: MCP6V66UT-E/LTY

## Nets that join several sheets
3V3: 0_Overview (U1.2), 1_Power (P103.3 P103.4), 3_MCU (9 pins)
3V3A: 1_Power (P104.3 P104.4), 3_MCU (C306.1 C307.1 U300.9), 4_Solder-Pen (5 pins)
5V: 0_Overview (5 pins), 1_Power (7 pins)
12V: 0_Overview (P1.3 P1.4 P2.3 P2.4), 1_Power (7 pins), 4_Solder-Pen (6 pins)
GND: 0_Overview (6 pins), 1_Power (22 pins), 2_FTDI (10 pins), 3_MCU (15 pins), 4_Solder-Pen (16 pins)
ADC1_11: 0_Overview (U1.5), 3_MCU (U300.18), 4_Solder-Pen (R404.1)
DAC_OUT: 0_Overview (P1.5), 3_MCU (U300.14)
ExtBoot: 0_Overview (P1.7), 3_MCU (D300.2)
HEAT_CSENSE_VOUT: 3_MCU (U300.17), 4_Solder-Pen (U401.7)
NetP1_17: 0_Overview (P1.17), 3_MCU (U300.28)
NetP1_18: 0_Overview (P1.18), 3_MCU (U300.27)
NetP1_19: 0_Overview (P1.19), 3_MCU (U300.26)
NetP1_20: 0_Overview (P1.20), 3_MCU (U300.25)
NetR400_1: 0_Overview (U1.6), 4_Solder-Pen (R400.1 R401.0)
nRESET: 0_Overview (P1.8 U1.4), 3_MCU (R304.0 U300.7)
OP_IN-: 0_Overview (R1.1 R2.1), 3_MCU (U300.15)
OP_OUT: 0_Overview (R1.0), 3_MCU (U300.16)
PA0: 0_Overview (P2.20), 3_MCU (U300.10)
PA3: 0_Overview (P2.19), 3_MCU (U300.13)
PA8: 0_Overview (P1.14), 3_MCU (U300.29)
PA11: 0_Overview (P1.13), 3_MCU (U300.32)
PA12: 0_Overview (P1.12), 3_MCU (U300.33)
PA15: 0_Overview (P2.18), 3_MCU (U300.38)
PB1: 0_Overview (P2.17), 3_MCU (U300.19)
PB2: 0_Overview (P2.16), 3_MCU (U300.20)
PB4: 0_Overview (P2.15), 3_MCU (U300.40)
PB6: 0_Overview (P2.14), 3_MCU (U300.42)
PB7: 0_Overview (P2.13), 3_MCU (U300.43)
PB8: 0_Overview (P2.12), 3_MCU (U300.45)
PB9: 0_Overview (P2.9), 3_MCU (U300.46)
PB10: 0_Overview (P2.8), 3_MCU (U300.21)
PC13: 0_Overview (P2.7), 3_MCU (U300.2)
PC14: 0_Overview (P2.6), 3_MCU (U300.3)
PC15: 0_Overview (P2.5), 3_MCU (U300.4)
PROT_INT: 0_Overview (U1.8), 3_MCU (U300.22)
RXD: 2_FTDI (FT200.5 TP201.0), 3_MCU (U300.30)
SPI3_MOSI: 0_Overview (P1.16), 3_MCU (U300.41)
SPI3_SCK: 0_Overview (P1.15), 3_MCU (R300.0)
TIM2_2: 0_Overview (U1.7), 3_MCU (U300.11)
TIM2_3: 0_Overview (P1.6), 3_MCU (U300.12)
TXD: 2_FTDI (FT200.1 TP200.0), 3_MCU (U300.31)
VBAT: 0_Overview (P1.9), 3_MCU (U300.1)